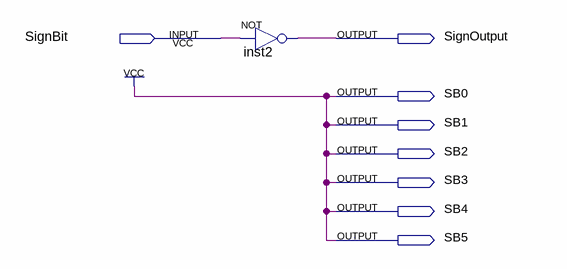
[diagram p0: schematic sheet]
// Quartus schematic SignDisplay.bdf as structural Verilog: 1 symbols, 8 pins
module SignDisplay (
  input  SignBit,
  output SignOutput,
  output SB0,
  output SB1,
  output SB2,
  output SB3,
  output SB4,
  output SB5
);

  not inst2 (SignOutput, SignBit);

  assign SB0 = 1'b1;
  assign SB1 = 1'b1;
  assign SB2 = 1'b1;
  assign SB3 = 1'b1;
  assign SB4 = 1'b1;
  assign SB5 = 1'b1;
endmodule
